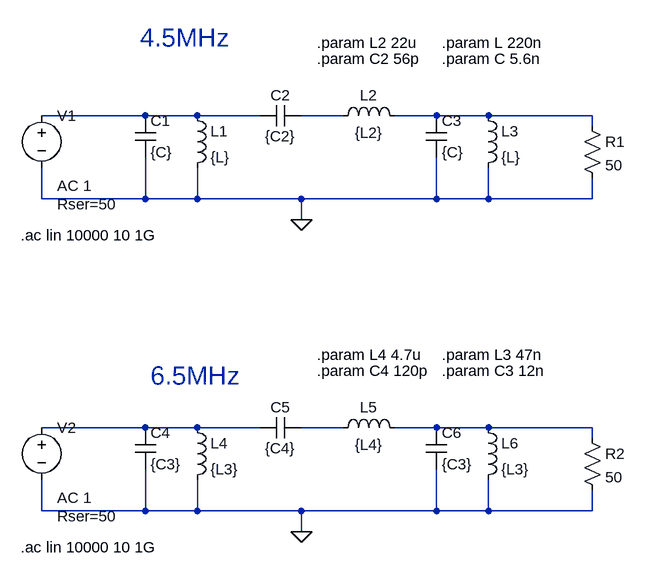
[diagram p0: schematic Band_Pass_Filters.asc]
Band_Pass_Filters.asc, the LTspice schematic file:
Version 4
SHEET 1 1016 840
WIRE 272 160 112 160
WIRE 352 160 272 160
WIRE 448 160 352 160
WIRE 576 160 512 160
WIRE 720 160 656 160
WIRE 800 160 720 160
WIRE 960 160 800 160
WIRE 960 176 960 160
WIRE 112 288 112 240
WIRE 272 288 272 224
WIRE 272 288 112 288
WIRE 352 288 352 240
WIRE 352 288 272 288
WIRE 512 288 352 288
WIRE 720 288 720 224
WIRE 720 288 512 288
WIRE 800 288 800 240
WIRE 800 288 720 288
WIRE 960 288 960 256
WIRE 960 288 800 288
WIRE 512 320 512 288
WIRE 272 640 112 640
WIRE 352 640 272 640
WIRE 448 640 352 640
WIRE 576 640 512 640
WIRE 720 640 656 640
WIRE 800 640 720 640
WIRE 960 640 800 640
WIRE 960 656 960 640
WIRE 112 768 112 720
WIRE 272 768 272 704
WIRE 272 768 112 768
WIRE 352 768 352 720
WIRE 352 768 272 768
WIRE 512 768 352 768
WIRE 720 768 720 704
WIRE 720 768 512 768
WIRE 800 768 800 720
WIRE 800 768 720 768
WIRE 960 768 960 736
WIRE 960 768 800 768
WIRE 512 800 512 768
FLAG 512 320 0
FLAG 512 800 0
SYMBOL voltage 112 144 R0
WINDOW 123 24 124 Left 2
WINDOW 39 24 152 Left 2
SYMATTR Value2 AC 1
SYMATTR SpiceLine Rser=50
SYMATTR InstName V1
SYMATTR Value ""
SYMBOL cap 256 160 R0
SYMATTR InstName C1
SYMATTR Value {C}
SYMBOL ind 336 144 R0
SYMATTR InstName L1
SYMATTR Value {L}
SYMBOL cap 512 144 R90
WINDOW 0 0 32 VBottom 2
WINDOW 3 32 32 VTop 2
SYMATTR InstName C2
SYMATTR Value {C2}
SYMBOL ind 560 176 R270
WINDOW 0 32 56 VTop 2
WINDOW 3 5 56 VBottom 2
SYMATTR InstName L2
SYMATTR Value {L2}
SYMBOL cap 704 160 R0
SYMATTR InstName C3
SYMATTR Value {C}
SYMBOL ind 784 144 R0
SYMATTR InstName L3
SYMATTR Value {L}
SYMBOL res 944 160 R0
SYMATTR InstName R1
SYMATTR Value 50
SYMBOL voltage 112 624 R0
WINDOW 123 24 124 Left 2
WINDOW 39 24 152 Left 2
SYMATTR Value2 AC 1
SYMATTR SpiceLine Rser=50
SYMATTR InstName V2
SYMATTR Value ""
SYMBOL cap 256 640 R0
SYMATTR InstName C4
SYMATTR Value {C3}
SYMBOL ind 336 624 R0
SYMATTR InstName L4
SYMATTR Value {L3}
SYMBOL cap 512 624 R90
WINDOW 0 0 32 VBottom 2
WINDOW 3 32 32 VTop 2
SYMATTR InstName C5
SYMATTR Value {C4}
SYMBOL ind 560 656 R270
WINDOW 0 32 56 VTop 2
WINDOW 3 5 56 VBottom 2
SYMATTR InstName L5
SYMATTR Value {L4}
SYMBOL cap 704 640 R0
SYMATTR InstName C6
SYMATTR Value {C3}
SYMBOL ind 784 624 R0
SYMATTR InstName L6
SYMATTR Value {L3}
SYMBOL res 944 640 R0
SYMATTR InstName R2
SYMATTR Value 50
TEXT 728 72 Left 2 !.param C 5.6n
TEXT 728 48 Left 2 !.param L 220n
TEXT 536 72 Left 2 !.param C2 56p
TEXT 536 48 Left 2 !.param L2 22u
TEXT 80 344 Left 2 !.ac lin 10000 10 1G
TEXT 264 40 Left 4 ;4.5MHz
TEXT 728 552 Left 2 !.param C3 12n
TEXT 536 552 Left 2 !.param C4 120p
TEXT 80 824 Left 2 !.ac lin 10000 10 1G
TEXT 728 528 Left 2 !.param L3 47n
TEXT 536 528 Left 2 !.param L4 4.7u
TEXT 280 560 Left 4 ;6.5MHz

The netlist it stands for:
* Band_Pass_Filters.asc
V1 N001 0 AC 1 Rser=50
C1 N001 0 {C}
L1 N001 0 {L}
C2 N002 N001 {C2}
L2 N002 N003 {L2}
C3 N003 0 {C}
L3 N003 0 {L}
R1 N003 0 50
V2 N004 0 AC 1 Rser=50
C4 N004 0 {C3}
L4 N004 0 {L3}
C5 N005 N004 {C4}
L5 N005 N006 {L4}
C6 N006 0 {C3}
L6 N006 0 {L3}
R2 N006 0 50
.param C 5.6n
.param L 220n
.param C2 56p
.param L2 22u
.ac lin 10000 10 1G
* 4.5MHz
.param C3 12n
.param C4 120p
.ac lin 10000 10 1G
.param L3 47n
.param L4 4.7u
* 6.5MHz
.backanno
.end